# Altium schematic sheet 02-Nucleo_Breakout.SchDoc
size B
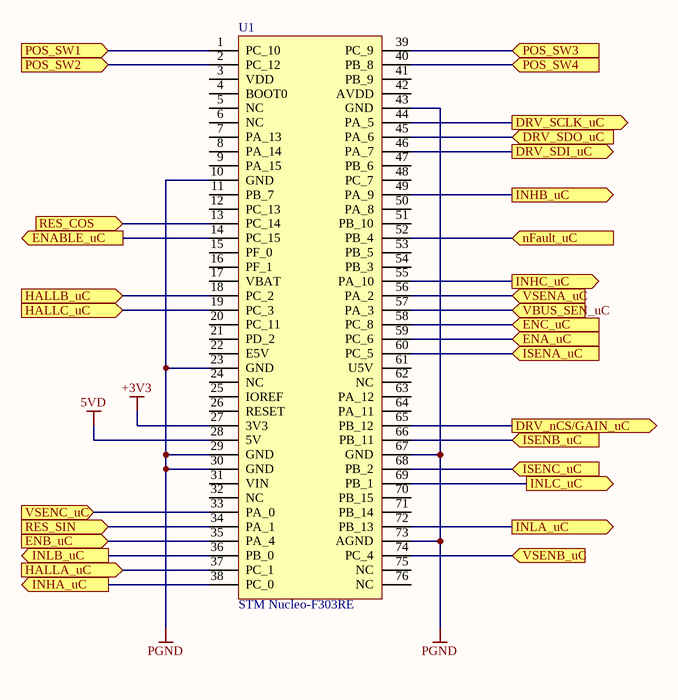
[diagram p0: 02-Nucleo_Breakout.SchDoc]

## Parts
U1  STM Nucleo-F303RE  [Nucleo MORPHO CONNECTORS]

## Ports
DRV_nCS/GAIN_uC (out), DRV_SCLK_uC (out), DRV_SDI_uC (out), DRV_SDO_uC (in), ENA_uC (in), ENABLE_uC (out), ENB_uC (in), ENC_uC (in), HALLA_uC (in), HALLB_uC (in), HALLC_uC (in), INHA_uC (out), INHB_uC (out), INHC_uC (out), INLA_uC (out), INLB_uC (out), INLC_uC (out), ISENA_uC (in), ISENB_uC (in), ISENC_uC (in), nFault_uC (in), POS_SW1 (in), POS_SW2 (in), POS_SW3 (in), POS_SW4 (in), RES_COS (in), RES_SIN (in), VBUS_SEN_uC (in), VSENA_uC (in), VSENB_uC (in), VSENC_uC (in)

## Nets
5VD: U1.28(5V)
+3V3: U1.27(3V3)
PGND: U1.10(GND) U1.23(GND) U1.29(GND) U1.30(GND) U1.43(GND) U1.67(GND) U1.73(AGND)
DRV_nCS/GAIN_uC: U1.65(PB_12) ; port DRV_nCS/GAIN_uC
DRV_SCLK_uC: U1.44(PA_5) ; port DRV_SCLK_uC
DRV_SDI_uC: U1.46(PA_7) ; port DRV_SDI_uC
DRV_SDO_uC: U1.45(PA_6) ; port DRV_SDO_uC
ENA_uC: U1.59(PC_6) ; port ENA_uC
ENABLE_uC: U1.14(PC_15) ; port ENABLE_uC
ENB_uC: U1.35(PA_4) ; port ENB_uC
ENC_uC: U1.58(PC_8) ; port ENC_uC
HALLA_uC: U1.37(PC_1) ; port HALLA_uC
HALLB_uC: U1.18(PC_2) ; port HALLB_uC
HALLC_uC: U1.19(PC_3) ; port HALLC_uC
INHA_uC: U1.38(PC_0) ; port INHA_uC
INHB_uC: U1.49(PA_9) ; port INHB_uC
INHC_uC: U1.55(PA_10) ; port INHC_uC
INLA_uC: U1.72(PB_13) ; port INLA_uC
INLB_uC: U1.36(PB_0) ; port INLB_uC
INLC_uC: U1.69(PB_1) ; port INLC_uC
ISENA_uC: U1.60(PC_5) ; port ISENA_uC
ISENB_uC: U1.66(PB_11) ; port ISENB_uC
ISENC_uC: U1.68(PB_2) ; port ISENC_uC
nFault_uC: U1.52(PB_4) ; port nFault_uC
POS_SW1: U1.1(PC_10) ; port POS_SW1
POS_SW2: U1.2(PC_12) ; port POS_SW2
POS_SW3: U1.39(PC_9) ; port POS_SW3
POS_SW4: U1.40(PB_8) ; port POS_SW4
RES_COS: U1.13(PC_14) ; port RES_COS
RES_SIN: U1.34(PA_1) ; port RES_SIN
VBUS_SEN_uC: U1.57(PA_3) ; port VBUS_SEN_uC
VSENA_uC: U1.56(PA_2) ; port VSENA_uC
VSENB_uC: U1.74(PC_4) ; port VSENB_uC
VSENC_uC: U1.33(PA_0) ; port VSENC_uC

Not connected (* = marked no-connect by the designer): U1 3(VDD) 4(BOOT0) 5(NC) 6(NC) 7(PA_13) 8(PA_14) 9(PA_15) 11(PB_7) 12(PC_13) 15(PF_0) 16(PF_1) 17(VBAT) 20(PC_11) 21(PD_2) 22(E5V) 24(NC) 25(IOREF) 26(RESET) 31(VIN) 32(NC) 41(PB_9) 42(AVDD) 47(PB_6) 48(PC_7) 50(PA_8) 51(PB_10) 53(PB_5) 54(PB_3) 61(U5V) 62(NC) 63(PA_12) 64(PA_11) 70(PB_15) 71(PB_14) 75(NC) 76(NC)